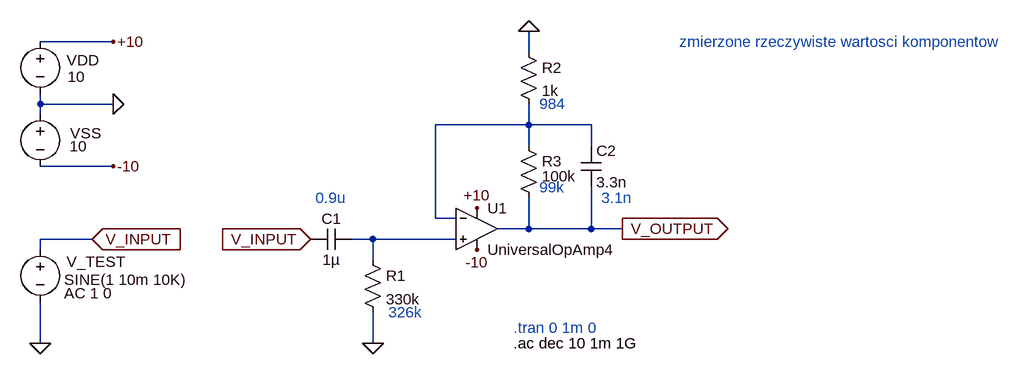
[diagram p0: schematic BP1.asc]
BP1.asc, the LTspice schematic file:
Version 4
SHEET 1 1400 680
WIRE -16 -384 -128 -384
WIRE 624 -368 624 -400
WIRE -128 -288 -128 -304
WIRE -16 -288 -128 -288
WIRE -128 -272 -128 -288
WIRE 624 -256 624 -288
WIRE 624 -256 480 -256
WIRE 720 -256 624 -256
WIRE 624 -224 624 -256
WIRE 720 -224 720 -256
WIRE -16 -192 -128 -192
WIRE 480 -112 480 -256
WIRE 512 -112 480 -112
WIRE 624 -96 624 -144
WIRE 624 -96 576 -96
WIRE 720 -96 720 -160
WIRE 720 -96 624 -96
WIRE 768 -96 720 -96
WIRE -48 -80 -128 -80
WIRE 384 -80 352 -80
WIRE 512 -80 384 -80
WIRE -128 -64 -128 -80
WIRE 384 -48 384 -80
WIRE -128 80 -128 16
WIRE 384 80 384 32
FLAG -16 -384 +10
FLAG -16 -192 -10
FLAG -16 -288 0
FLAG 288 -80 V_INPUT
IOPIN 288 -80 In
FLAG 768 -96 V_OUTPUT
IOPIN 768 -96 Out
FLAG 544 -128 +10
FLAG 544 -64 -10
FLAG -128 80 0
FLAG -48 -80 V_INPUT
IOPIN -48 -80 In
FLAG 384 80 0
FLAG 624 -400 0
SYMBOL voltage -128 -400 R0
WINDOW 0 41 45 Left 2
WINDOW 3 42 70 Left 2
WINDOW 123 0 0 Left 0
WINDOW 39 0 0 Left 0
SYMATTR InstName VDD
SYMATTR Value 10
SYMBOL voltage -128 -288 R0
WINDOW 0 46 45 Left 2
WINDOW 3 45 65 Left 2
WINDOW 123 0 0 Left 0
WINDOW 39 0 0 Left 0
SYMATTR InstName VSS
SYMATTR Value 10
SYMBOL voltage -128 -80 R0
WINDOW 0 41 35 Left 2
WINDOW 3 37 62 Left 2
WINDOW 123 37 83 Left 2
WINDOW 39 0 0 Left 0
SYMATTR InstName V_TEST
SYMATTR Value SINE(1 10m 10K)
SYMATTR Value2 AC 1 0
SYMBOL OpAmps\\UniversalOpAmp4 544 -96 R0
SYMATTR InstName U1
SYMATTR Value2 Avol=205k GBW=4MEG Slew=13MEG
SYMATTR SpiceLine Ilimit=25m Rail=0.6 Vos=5m Phimargin=45
SYMATTR SpiceLine2 En=0 Enk=0 In=0 Ink=0 Rin=1000000000000 Ro=1k Ccm=1p Cdiff=2p
SYMBOL cap 352 -96 R90
WINDOW 0 0 32 VBottom 2
WINDOW 3 32 32 VTop 2
SYMATTR InstName C1
SYMATTR Value 1µ
SYMBOL res 368 -64 R0
SYMATTR InstName R1
SYMATTR Value 330k
SYMBOL res 608 -240 R0
WINDOW 3 36 63 Left 2
SYMATTR Value 100k
SYMATTR InstName R3
SYMBOL cap 704 -224 R0
SYMATTR InstName C2
SYMATTR Value 3.3n
SYMBOL res 608 -384 R0
SYMATTR InstName R2
SYMATTR Value 1k
TEXT 600 56 Left 2 ;.tran 0 1m 0
TEXT 600 80 Left 2 !.ac dec 10 1m 1G
TEXT 296 -144 Left 2 ;0.9u
TEXT 408 32 Left 2 ;326k
TEXT 640 -288 Left 2 ;984
TEXT 640 -160 Left 2 ;99k
TEXT 736 -144 Left 2 ;3.1n
TEXT 856 -384 Left 2 ;zmierzone rzeczywiste wartosci komponentow

The netlist it stands for:
* BP1.asc
VDD +10 0 10
VSS 0 -10 10
V_TEST V_INPUT 0 SINE(1 10m 10K) AC 1 0
* U1: UniversalOpAmp4 Avol=205k GBW=4MEG Slew=13MEG Ilimit=25m Rail=0.6 Vos=5m Phimargin=45 En=0 Enk=0 In=0 Ink=0 Rin=1000000000000 Ro=1k Ccm=1p Cdiff=2p (symbol OpAmps\UniversalOpAmp4 not available, pins judged from their places): In+=N002 In-=N001 V+=+10 V-=-10 OUT=V_OUTPUT
C1 N002 V_INPUT 1µ
R1 N002 0 330k
R3 N001 V_OUTPUT 100k
C2 N001 V_OUTPUT 3.3n
R2 0 N001 1k
* .tran 0 1m 0
.ac dec 10 1m 1G
* 0.9u
* 326k
* 984
* 99k
* 3.1n
* zmierzone rzeczywiste wartosci komponentow
.backanno
.end